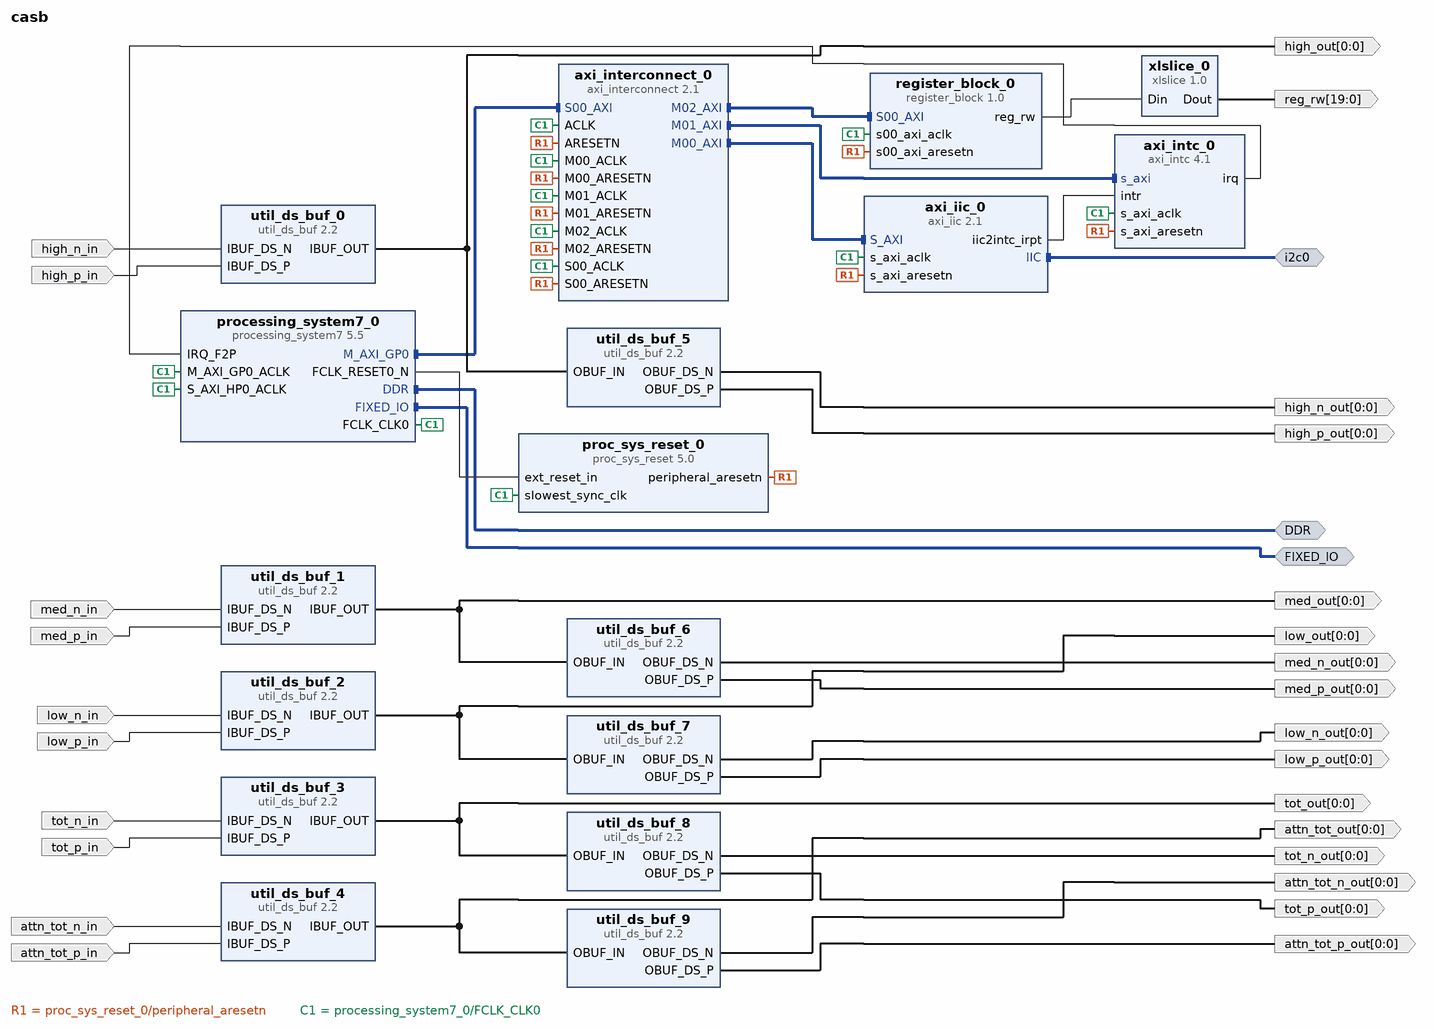
[diagram p0: block diagram of the top level]
# Vivado block design casb, xc7z020clg400-1, Vivado 2023.2
create_bd_design casb

create_bd_intf_port -mode Master -vlnv xilinx.com:interface:ddrx_rtl:1.0 DDR
create_bd_intf_port -mode Master -vlnv xilinx.com:display_processing_system7:fixedio_rtl:1.0 FIXED_IO
create_bd_intf_port -mode Master -vlnv xilinx.com:interface:iic_rtl:1.0 i2c0
create_bd_port -dir I -type data high_p_in
create_bd_port -dir I -type data high_n_in
create_bd_port -dir I -type data med_p_in
create_bd_port -dir I -type data med_n_in
create_bd_port -dir I -type data low_p_in
create_bd_port -dir I -type data low_n_in
create_bd_port -dir I -type data tot_p_in
create_bd_port -dir I -type data tot_n_in
create_bd_port -dir I -type data attn_tot_p_in
create_bd_port -dir I -type data attn_tot_n_in
create_bd_port -dir O -from 0 -to 0 -type data high_p_out
create_bd_port -dir O -from 0 -to 0 -type data high_n_out
create_bd_port -dir O -from 0 -to 0 -type data med_p_out
create_bd_port -dir O -from 0 -to 0 -type data med_n_out
create_bd_port -dir O -from 0 -to 0 -type data low_p_out
create_bd_port -dir O -from 0 -to 0 -type data low_n_out
create_bd_port -dir O -from 0 -to 0 -type data attn_tot_n_out
create_bd_port -dir O -from 0 -to 0 -type data tot_p_out
create_bd_port -dir O -from 0 -to 0 -type data tot_n_out
create_bd_port -dir O -from 0 -to 0 -type data attn_tot_p_out
create_bd_port -dir O -from 19 -to 0 reg_rw
create_bd_port -dir O -from 0 -to 0 attn_tot_out
create_bd_port -dir O -from 0 -to 0 high_out
create_bd_port -dir O -from 0 -to 0 low_out
create_bd_port -dir O -from 0 -to 0 med_out
create_bd_port -dir O -from 0 -to 0 tot_out

create_bd_cell -type ip -vlnv xilinx.com:ip:processing_system7:5.5 processing_system7_0
set_property -dict [list \
  CONFIG.PCW_APU_PERIPHERAL_FREQMHZ 666.666666 \
  CONFIG.PCW_CAN0_CAN0_IO {MIO 14 .. 15} \
  CONFIG.PCW_CAN0_PERIPHERAL_ENABLE 1 \
  CONFIG.PCW_ENET0_ENET0_IO {MIO 16 .. 27} \
  CONFIG.PCW_ENET0_GRP_MDIO_ENABLE 1 \
  CONFIG.PCW_ENET0_GRP_MDIO_IO {MIO 52 .. 53} \
  CONFIG.PCW_ENET0_PERIPHERAL_CLKSRC {ARM PLL} \
  CONFIG.PCW_ENET0_PERIPHERAL_ENABLE 1 \
  CONFIG.PCW_ENET0_RESET_ENABLE 0 \
  CONFIG.PCW_ENET_RESET_ENABLE 1 \
  CONFIG.PCW_ENET_RESET_SELECT {Share reset pin} \
  CONFIG.PCW_FPGA0_PERIPHERAL_FREQMHZ 100 \
  CONFIG.PCW_FPGA1_PERIPHERAL_FREQMHZ 50 \
  CONFIG.PCW_GPIO_MIO_GPIO_ENABLE 1 \
  CONFIG.PCW_GPIO_MIO_GPIO_IO MIO \
  CONFIG.PCW_GPIO_PERIPHERAL_ENABLE 1 \
  CONFIG.PCW_I2C_RESET_ENABLE 1 \
  CONFIG.PCW_IRQ_F2P_INTR 1 \
  CONFIG.PCW_PRESET_BANK1_VOLTAGE {LVCMOS 1.8V} \
  CONFIG.PCW_QSPI_GRP_FBCLK_ENABLE 1 \
  CONFIG.PCW_QSPI_GRP_FBCLK_IO {MIO 8} \
  CONFIG.PCW_QSPI_GRP_SINGLE_SS_ENABLE 1 \
  CONFIG.PCW_QSPI_GRP_SINGLE_SS_IO {MIO 1 .. 6} \
  CONFIG.PCW_QSPI_PERIPHERAL_ENABLE 1 \
  CONFIG.PCW_QSPI_QSPI_IO {MIO 1 .. 6} \
  CONFIG.PCW_SD0_GRP_CD_ENABLE 1 \
  CONFIG.PCW_SD0_GRP_CD_IO {MIO 46} \
  CONFIG.PCW_SD0_GRP_WP_ENABLE 1 \
  CONFIG.PCW_SD0_GRP_WP_IO {MIO 47} \
  CONFIG.PCW_SD0_PERIPHERAL_ENABLE 1 \
  CONFIG.PCW_SD0_SD0_IO {MIO 40 .. 45} \
  CONFIG.PCW_SDIO_PERIPHERAL_FREQMHZ 100 \
  CONFIG.PCW_SINGLE_QSPI_DATA_MODE x4 \
  CONFIG.PCW_TTC0_PERIPHERAL_ENABLE 1 \
  CONFIG.PCW_TTC0_TTC0_IO EMIO \
  CONFIG.PCW_UART0_PERIPHERAL_ENABLE 1 \
  CONFIG.PCW_UART0_UART0_IO {MIO 10 .. 11} \
  CONFIG.PCW_UART1_PERIPHERAL_ENABLE 1 \
  CONFIG.PCW_UART1_UART1_IO {MIO 48 .. 49} \
  CONFIG.PCW_UART_PERIPHERAL_FREQMHZ 100 \
  CONFIG.PCW_UIPARAM_DDR_PARTNO {MT41J256M16 RE-125} \
  CONFIG.PCW_USB0_PERIPHERAL_ENABLE 1 \
  CONFIG.PCW_USB0_RESET_ENABLE 1 \
  CONFIG.PCW_USB0_RESET_IO {MIO 51} \
  CONFIG.PCW_USB0_USB0_IO {MIO 28 .. 39} \
  CONFIG.PCW_USB_RESET_ENABLE 1 \
  CONFIG.PCW_USB_RESET_SELECT {Share reset pin} \
  CONFIG.PCW_USE_FABRIC_INTERRUPT 1 \
  CONFIG.PCW_USE_S_AXI_HP0 1 \
] [get_bd_cells processing_system7_0]
# 285 more settings of processing_system7_0 are not shown: defaults, MIO pin electricals, DDR timing, and values the tool derives
create_bd_cell -type ip -vlnv xilinx.com:ip:proc_sys_reset:5.0 proc_sys_reset_0
create_bd_cell -type ip -vlnv xilinx.com:ip:axi_iic:2.1 axi_iic_0
set_property -dict {CONFIG.IIC_BOARD_INTERFACE i2c0 CONFIG.USE_BOARD_FLOW true} [get_bd_cells axi_iic_0]
create_bd_cell -type ip -vlnv xilinx.com:ip:axi_intc:4.1 axi_intc_0
set_property -dict [list \
  CONFIG.C_IRQ_CONNECTION 1 \
  CONFIG.C_PROCESSOR_CLK_FREQ_MHZ 100 \
  CONFIG.C_S_AXI_ACLK_FREQ_MHZ 100 \
] [get_bd_cells axi_intc_0]
create_bd_cell -type ip -vlnv xilinx.com:ip:axi_interconnect:2.1 axi_interconnect_0
set_property -dict {CONFIG.NUM_MI 3} [get_bd_cells axi_interconnect_0]
create_bd_cell -type ip -vlnv xilinx.com:ip:util_ds_buf:2.2 util_ds_buf_0
create_bd_cell -type ip -vlnv xilinx.com:ip:util_ds_buf:2.2 util_ds_buf_1
create_bd_cell -type ip -vlnv xilinx.com:ip:util_ds_buf:2.2 util_ds_buf_2
create_bd_cell -type ip -vlnv xilinx.com:ip:util_ds_buf:2.2 util_ds_buf_3
create_bd_cell -type ip -vlnv xilinx.com:ip:util_ds_buf:2.2 util_ds_buf_4
create_bd_cell -type ip -vlnv xilinx.com:ip:util_ds_buf:2.2 util_ds_buf_5
set_property -dict {CONFIG.C_BUF_TYPE OBUFDS} [get_bd_cells util_ds_buf_5]
create_bd_cell -type ip -vlnv xilinx.com:ip:util_ds_buf:2.2 util_ds_buf_6
set_property -dict {CONFIG.C_BUF_TYPE OBUFDS} [get_bd_cells util_ds_buf_6]
create_bd_cell -type ip -vlnv xilinx.com:ip:util_ds_buf:2.2 util_ds_buf_7
set_property -dict {CONFIG.C_BUF_TYPE OBUFDS} [get_bd_cells util_ds_buf_7]
create_bd_cell -type ip -vlnv xilinx.com:ip:util_ds_buf:2.2 util_ds_buf_8
set_property -dict {CONFIG.C_BUF_TYPE OBUFDS} [get_bd_cells util_ds_buf_8]
create_bd_cell -type ip -vlnv xilinx.com:ip:util_ds_buf:2.2 util_ds_buf_9
set_property -dict {CONFIG.C_BUF_TYPE OBUFDS} [get_bd_cells util_ds_buf_9]
create_bd_cell -type ip -vlnv user.org:user:register_block:1.0 register_block_0
create_bd_cell -type ip -vlnv xilinx.com:ip:xlslice:1.0 xlslice_0
set_property -dict {CONFIG.DIN_FROM 19 CONFIG.DIN_TO 0 CONFIG.DIN_WIDTH 128 CONFIG.DOUT_WIDTH 20} [get_bd_cells xlslice_0]

# ---- connections ----

connect_bd_intf_net [get_bd_intf_ports i2c0] [get_bd_intf_pins axi_iic_0/IIC]
connect_bd_intf_net [get_bd_intf_pins axi_interconnect_0/M00_AXI] [get_bd_intf_pins axi_iic_0/S_AXI]
connect_bd_intf_net [get_bd_intf_pins axi_interconnect_0/M01_AXI] [get_bd_intf_pins axi_intc_0/s_axi]
connect_bd_intf_net [get_bd_intf_pins axi_interconnect_0/M02_AXI] [get_bd_intf_pins register_block_0/S00_AXI]
connect_bd_intf_net [get_bd_intf_ports DDR] [get_bd_intf_pins processing_system7_0/DDR]
connect_bd_intf_net [get_bd_intf_ports FIXED_IO] [get_bd_intf_pins processing_system7_0/FIXED_IO]
connect_bd_intf_net [get_bd_intf_pins processing_system7_0/M_AXI_GP0] [get_bd_intf_pins axi_interconnect_0/S00_AXI]
connect_bd_net [get_bd_ports attn_tot_n_in] [get_bd_pins util_ds_buf_4/IBUF_DS_N]
connect_bd_net [get_bd_ports attn_tot_p_in] [get_bd_pins util_ds_buf_4/IBUF_DS_P]
connect_bd_net [get_bd_pins axi_iic_0/iic2intc_irpt] [get_bd_pins axi_intc_0/intr]
connect_bd_net [get_bd_pins axi_intc_0/irq] [get_bd_pins processing_system7_0/IRQ_F2P]
connect_bd_net [get_bd_ports high_n_in] [get_bd_pins util_ds_buf_0/IBUF_DS_N]
connect_bd_net [get_bd_ports high_p_in] [get_bd_pins util_ds_buf_0/IBUF_DS_P]
connect_bd_net [get_bd_ports low_n_in] [get_bd_pins util_ds_buf_2/IBUF_DS_N]
connect_bd_net [get_bd_ports low_p_in] [get_bd_pins util_ds_buf_2/IBUF_DS_P]
connect_bd_net [get_bd_ports med_n_in] [get_bd_pins util_ds_buf_1/IBUF_DS_N]
connect_bd_net [get_bd_ports med_p_in] [get_bd_pins util_ds_buf_1/IBUF_DS_P]
connect_bd_net [get_bd_pins proc_sys_reset_0/peripheral_aresetn] \
  [get_bd_pins axi_interconnect_0/S00_ARESETN] [get_bd_pins axi_iic_0/s_axi_aresetn] \
  [get_bd_pins axi_interconnect_0/M00_ARESETN] [get_bd_pins axi_interconnect_0/ARESETN] \
  [get_bd_pins axi_intc_0/s_axi_aresetn] [get_bd_pins axi_interconnect_0/M01_ARESETN] \
  [get_bd_pins axi_interconnect_0/M02_ARESETN] [get_bd_pins register_block_0/s00_axi_aresetn]
connect_bd_net [get_bd_pins processing_system7_0/FCLK_CLK0] \
  [get_bd_pins proc_sys_reset_0/slowest_sync_clk] [get_bd_pins processing_system7_0/M_AXI_GP0_ACLK] \
  [get_bd_pins axi_interconnect_0/S00_ACLK] [get_bd_pins axi_iic_0/s_axi_aclk] [get_bd_pins axi_interconnect_0/M00_ACLK] \
  [get_bd_pins axi_interconnect_0/ACLK] [get_bd_pins axi_intc_0/s_axi_aclk] [get_bd_pins axi_interconnect_0/M01_ACLK] \
  [get_bd_pins processing_system7_0/S_AXI_HP0_ACLK] [get_bd_pins axi_interconnect_0/M02_ACLK] \
  [get_bd_pins register_block_0/s00_axi_aclk]
connect_bd_net [get_bd_pins processing_system7_0/FCLK_RESET0_N] [get_bd_pins proc_sys_reset_0/ext_reset_in]
connect_bd_net [get_bd_pins register_block_0/reg_rw] [get_bd_pins xlslice_0/Din]
connect_bd_net [get_bd_ports tot_n_in] [get_bd_pins util_ds_buf_3/IBUF_DS_N]
connect_bd_net [get_bd_ports tot_p_in] [get_bd_pins util_ds_buf_3/IBUF_DS_P]
connect_bd_net [get_bd_pins util_ds_buf_0/IBUF_OUT] [get_bd_ports high_out] [get_bd_pins util_ds_buf_5/OBUF_IN]
connect_bd_net [get_bd_pins util_ds_buf_1/IBUF_OUT] [get_bd_ports med_out] [get_bd_pins util_ds_buf_6/OBUF_IN]
connect_bd_net [get_bd_pins util_ds_buf_2/IBUF_OUT] [get_bd_ports low_out] [get_bd_pins util_ds_buf_7/OBUF_IN]
connect_bd_net [get_bd_pins util_ds_buf_3/IBUF_OUT] [get_bd_ports tot_out] [get_bd_pins util_ds_buf_8/OBUF_IN]
connect_bd_net [get_bd_pins util_ds_buf_4/IBUF_OUT] [get_bd_ports attn_tot_out] [get_bd_pins util_ds_buf_9/OBUF_IN]
connect_bd_net [get_bd_pins util_ds_buf_5/OBUF_DS_N] [get_bd_ports high_n_out]
connect_bd_net [get_bd_pins util_ds_buf_5/OBUF_DS_P] [get_bd_ports high_p_out]
connect_bd_net [get_bd_pins util_ds_buf_6/OBUF_DS_N] [get_bd_ports med_n_out]
connect_bd_net [get_bd_pins util_ds_buf_6/OBUF_DS_P] [get_bd_ports med_p_out]
connect_bd_net [get_bd_pins util_ds_buf_7/OBUF_DS_N] [get_bd_ports low_n_out]
connect_bd_net [get_bd_pins util_ds_buf_7/OBUF_DS_P] [get_bd_ports low_p_out]
connect_bd_net [get_bd_pins util_ds_buf_8/OBUF_DS_N] [get_bd_ports tot_n_out]
connect_bd_net [get_bd_pins util_ds_buf_8/OBUF_DS_P] [get_bd_ports tot_p_out]
connect_bd_net [get_bd_pins util_ds_buf_9/OBUF_DS_N] [get_bd_ports attn_tot_n_out]
connect_bd_net [get_bd_pins util_ds_buf_9/OBUF_DS_P] [get_bd_ports attn_tot_p_out]
connect_bd_net [get_bd_pins xlslice_0/Dout] [get_bd_ports reg_rw]

# ---- address map ----
assign_bd_address -offset 0x41600000 -range 64K -target_address_space [get_bd_addr_spaces processing_system7_0/Data] [get_bd_addr_segs axi_iic_0/S_AXI/Reg]
assign_bd_address -offset 0x41800000 -range 64K -target_address_space [get_bd_addr_spaces processing_system7_0/Data] [get_bd_addr_segs axi_intc_0/S_AXI/Reg]
assign_bd_address -offset 0x43C00000 -range 64K -target_address_space [get_bd_addr_spaces processing_system7_0/Data] [get_bd_addr_segs register_block_0/S00_AXI/S00_AXI_reg]

set_property USER_COMMENTS.comment_0 {Retrigger Logic Goes Here} [current_bd_design]
set_property USER_COMMENTS.comment_1 {DGT, LOCKOUT, SPARE1, SPARE2} [current_bd_design]
set_property USER_COMMENTS.comment_2 { SPARE1, SPARE2} [current_bd_design]

validate_bd_design
save_bd_design
